# EAGLE schematic Schematic (EAGLE 9.7.0)

## Sheet 1 of 4: Power
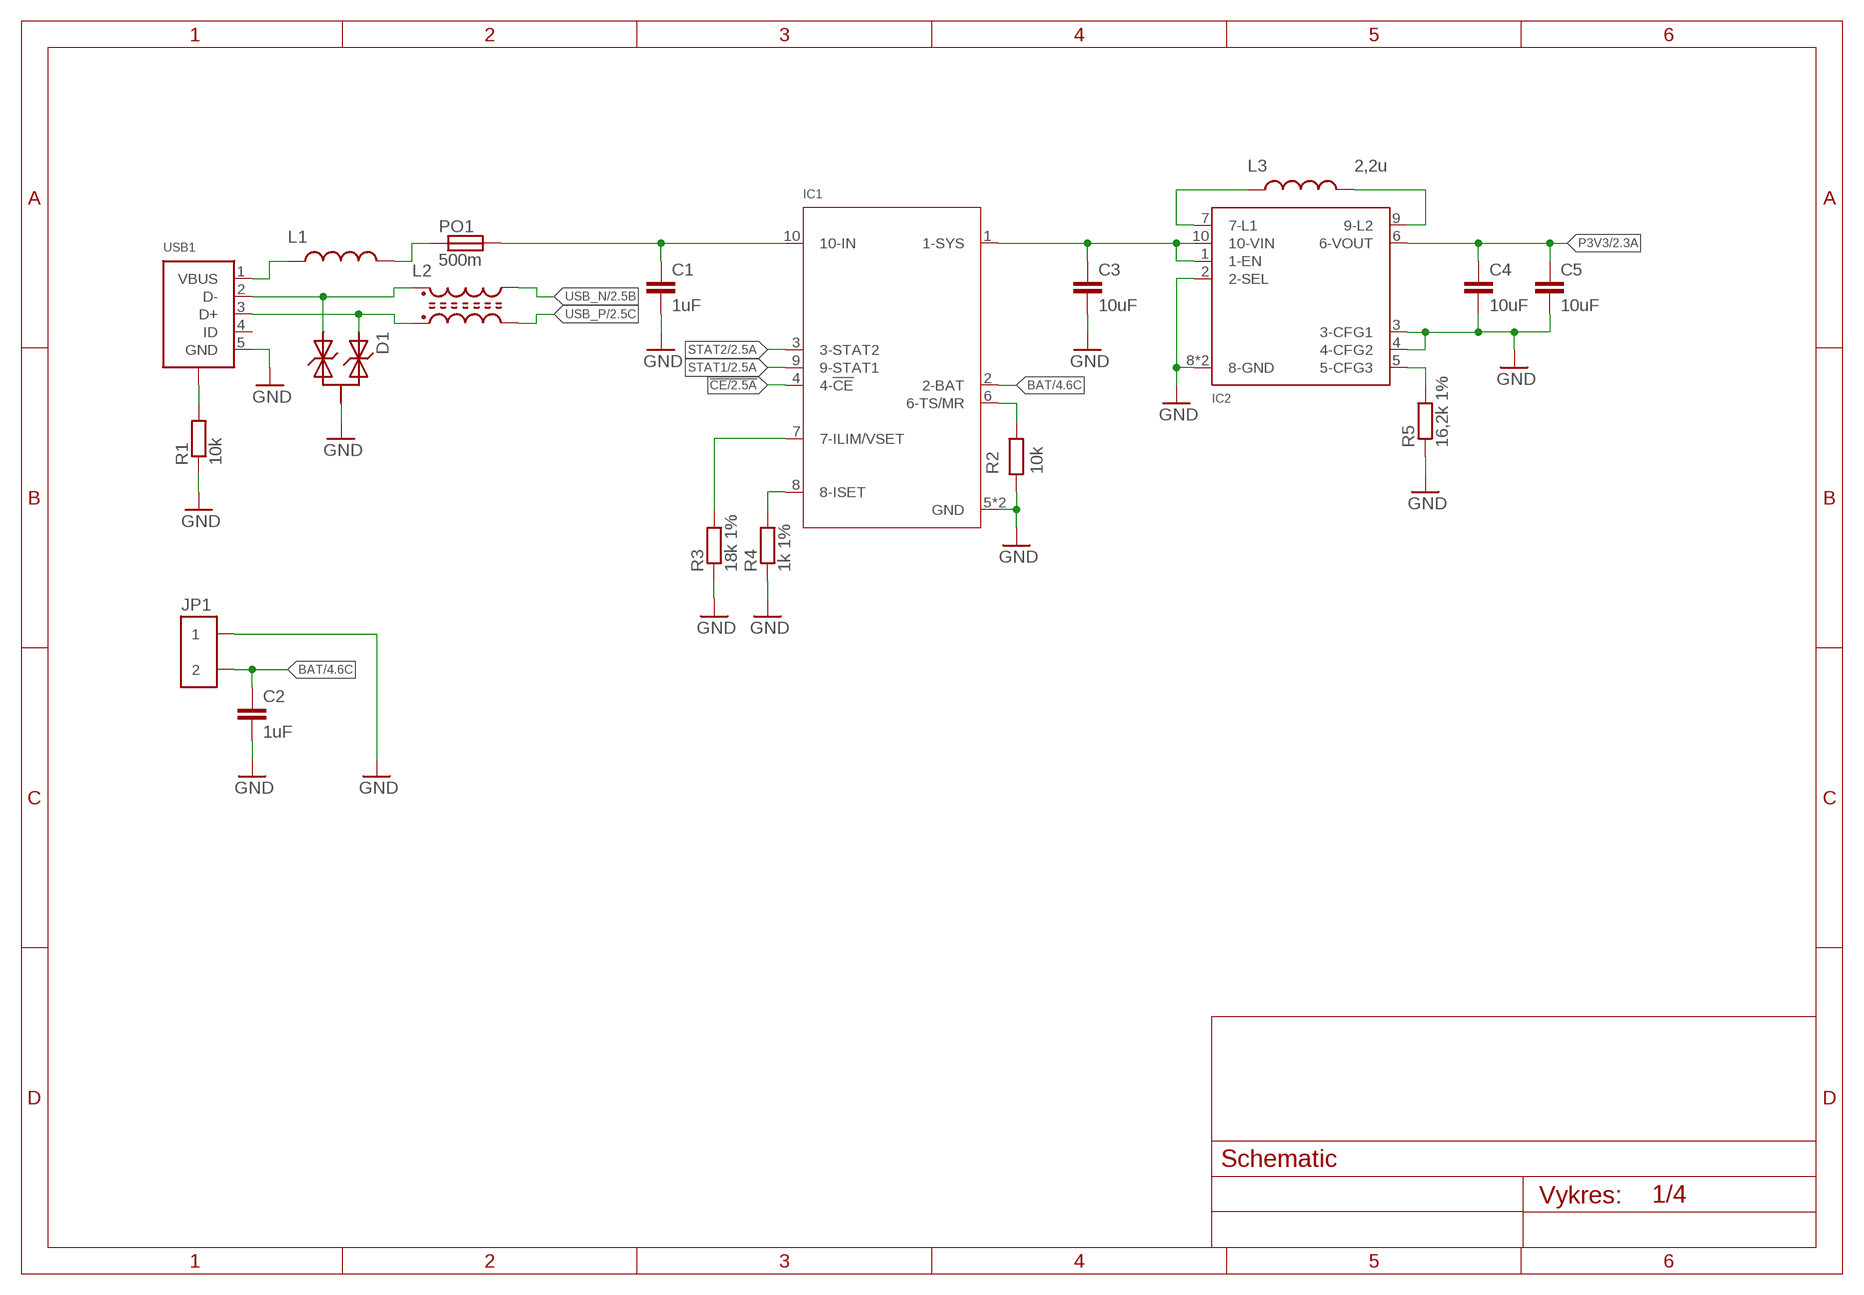
[diagram p0: schematic, sheet 1]

### Parts
C1  1uF  C-EU0603  [CAP-0603]
C2  1uF  C-EU0603  [CAP-0603]
C3  10uF  C-EU0603  [CAP-0603]
C4  10uF  C-EU0603  [CAP-0603]
C5  10uF  C-EU0603  [CAP-0603]
D1  DIODE-TVS-2SOT23-R  [SOT23-R]
IC1  BQ25185WSON-10-2.2X2MM  [WSON-10-2.2X2MM]
IC2  TPS63900WSON-10-2.5X2.5MM  [WSON-10-2.5X2.5MM]
JP1  JSTJST-B2B-PH-ANGLED  [JST-B2B-PH-ANGLED]
L1  INDUCTOR0603  [IND-0603]
L2  INDUCTOR-CHOKEIND-CHOKE-0805  [IND-CHOKE-0805]
L3  2,2u  INDUCTOR0805  [IND-0805]
PO1  500m  FUSE0805  [PTC-0805]
R1  10k  RESISTOR0402  [RES-0402]
R2  10k  RESISTOR0402  [RES-0402]
R3  18k 1%  RESISTOR0402  [RES-0402]
R4  1k 1%  RESISTOR0402  [RES-0402]
R5  16,2k 1%  RESISTOR0402  [RES-0402]
USB1  MICRO-USBMICRO-USB  [MICRO-USB]

### Nets
!CE: IC1.4(4-!CE) ; also sheet 2
BAT: C2.1 IC1.2(2-BAT) JP1.P$2 ; also sheet 4
CON-USB_N: D1.2 L2.1 USB1.2(D-)
CON-USB_P: D1.1 L2.4 USB1.3(D+)
GND: C1.2 C2.2 C3.2 C4.2 C5.2 D1.3 IC1.5(GND) IC1.11(GND) IC2.2(2-SEL) IC2.3(3-CFG1) IC2.4(4-CFG2) IC2.8(8-GND) IC2.11(8-GND) JP1.P$1 R1.1 R2.1 R3.1 R4.1 R5.1 USB1.5(GND) ; also sheet 2,3,4
ILIM: IC1.7(7-ILIM/VSET) R3.2
IN: C1.1 IC1.10(10-IN) PO1.2
ISET: IC1.8(8-ISET) R4.2
LX1: IC2.7(7-L1) L3.1
LX2: IC2.9(9-L2) L3.2
N$11: IC2.5(5-CFG3) R5.2
P3V3: C4.1 C5.1 IC2.6(6-VOUT) ; also sheet 2,3,4
SHIELD: R1.2 USB1.6(SHIELD) USB1.7(SHIELD) USB1.8(SHIELD) USB1.9(SHIELD) USB1.10(SHIELD) USB1.11(SHIELD)
STAT1: IC1.9(9-STAT1) ; also sheet 2
STAT2: IC1.3(3-STAT2) ; also sheet 2
SYS: C3.1 IC1.1(1-SYS) IC2.1(1-EN) IC2.10(10-VIN)
TS: IC1.6(6-TS/MR) R2.2
USB-VBUS: L1.1 USB1.1(VBUS)
USB_N: L2.2 ; also sheet 2
USB_P: L2.3 ; also sheet 2
VBUS-FUSE: L1.2 PO1.1
Unconnected: USB1.4(ID)

## Sheet 2 of 4: MCU
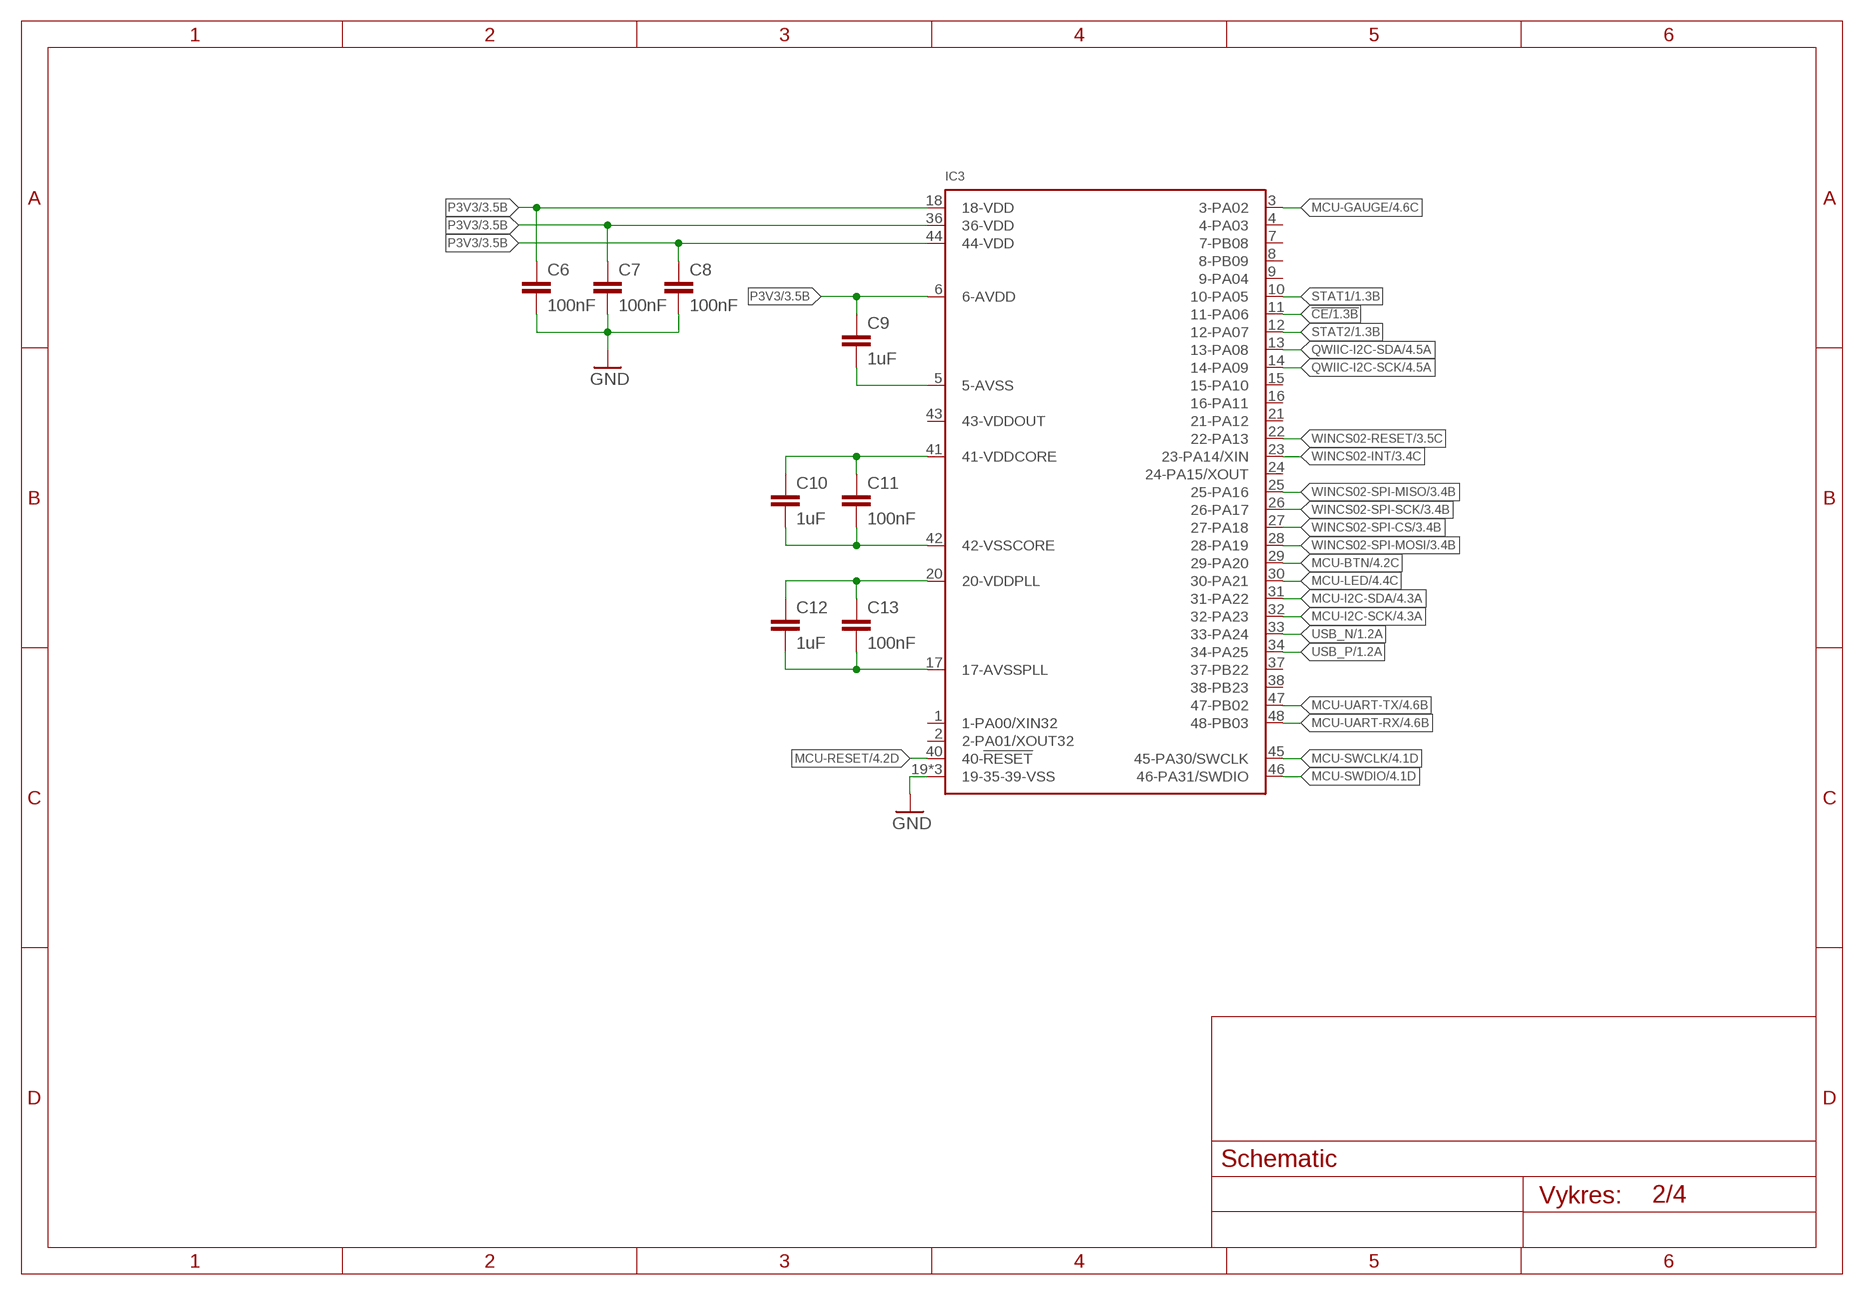
[diagram p1: schematic, sheet 2]

### Parts
C6  100nF  C-EU0402  [CAP-0402]
C7  100nF  C-EU0402  [CAP-0402]
C8  100nF  C-EU0402  [CAP-0402]
C9  1uF  C-EU0603  [CAP-0603]
C10  1uF  C-EU0603  [CAP-0603]
C11  100nF  C-EU0402  [CAP-0402]
C12  1uF  C-EU0603  [CAP-0603]
C13  100nF  C-EU0402  [CAP-0402]
IC3  PIC32CM2532LE00048TQFP-48  [TQFP-48]

### Nets
!CE: IC3.11(11-PA06) ; also sheet 1
GND: C6.2 C7.2 C8.2 C9.2 C10.2 C11.2 C12.2 C13.2 IC3.5(5-AVSS) IC3.17(17-AVSSPLL) IC3.19(19-35-39-VSS) IC3.35(19-35-39-VSS) IC3.39(19-35-39-VSS) IC3.42(42-VSSCORE) ; also sheet 1,3,4
MCU-BTN: IC3.29(29-PA20) ; also sheet 4
MCU-GAUGE: IC3.3(3-PA02) ; also sheet 4
MCU-I2C-SCK: IC3.32(32-PA23) ; also sheet 4
MCU-I2C-SDA: IC3.31(31-PA22) ; also sheet 4
MCU-LED: IC3.30(30-PA21) ; also sheet 4
MCU-RESET: IC3.40(40-!RESET) ; also sheet 4
MCU-SWCLK: IC3.45(45-PA30/SWCLK) ; also sheet 4
MCU-SWDIO: IC3.46(46-PA31/SWDIO) ; also sheet 4
MCU-UART-RX: IC3.48(48-PB03) ; also sheet 4
MCU-UART-TX: IC3.47(47-PB02) ; also sheet 4
P3V3: C6.1 C7.1 C8.1 C9.1 IC3.6(6-AVDD) IC3.18(18-VDD) IC3.36(36-VDD) IC3.44(44-VDD) ; also sheet 1,3,4
QWIIC-I2C-SCK: IC3.14(14-PA09) ; also sheet 4
QWIIC-I2C-SDA: IC3.13(13-PA08) ; also sheet 4
STAT1: IC3.10(10-PA05) ; also sheet 1
STAT2: IC3.12(12-PA07) ; also sheet 1
USB_N: IC3.33(33-PA24) ; also sheet 1
USB_P: IC3.34(34-PA25) ; also sheet 1
VDDCORE: C10.1 C11.1 IC3.41(41-VDDCORE)
VDDPLL: C12.1 C13.1 IC3.20(20-VDDPLL)
WINCS02-INT: IC3.23(23-PA14/XIN) ; also sheet 3
WINCS02-RESET: IC3.22(22-PA13) ; also sheet 3
WINCS02-SPI-CS: IC3.27(27-PA18) ; also sheet 3
WINCS02-SPI-MISO: IC3.25(25-PA16) ; also sheet 3
WINCS02-SPI-MOSI: IC3.28(28-PA19) ; also sheet 3
WINCS02-SPI-SCK: IC3.26(26-PA17) ; also sheet 3
Unconnected: IC3.1(1-PA00/XIN32) IC3.2(2-PA01/XOUT32) IC3.4(4-PA03) IC3.7(7-PB08) IC3.8(8-PB09) IC3.9(9-PA04) IC3.15(15-PA10) IC3.16(16-PA11) IC3.21(21-PA12) IC3.24(24-PA15/XOUT) IC3.37(37-PB22) IC3.38(38-PB23) IC3.43(43-VDDOUT)

## Sheet 3 of 4: Wi-Fi
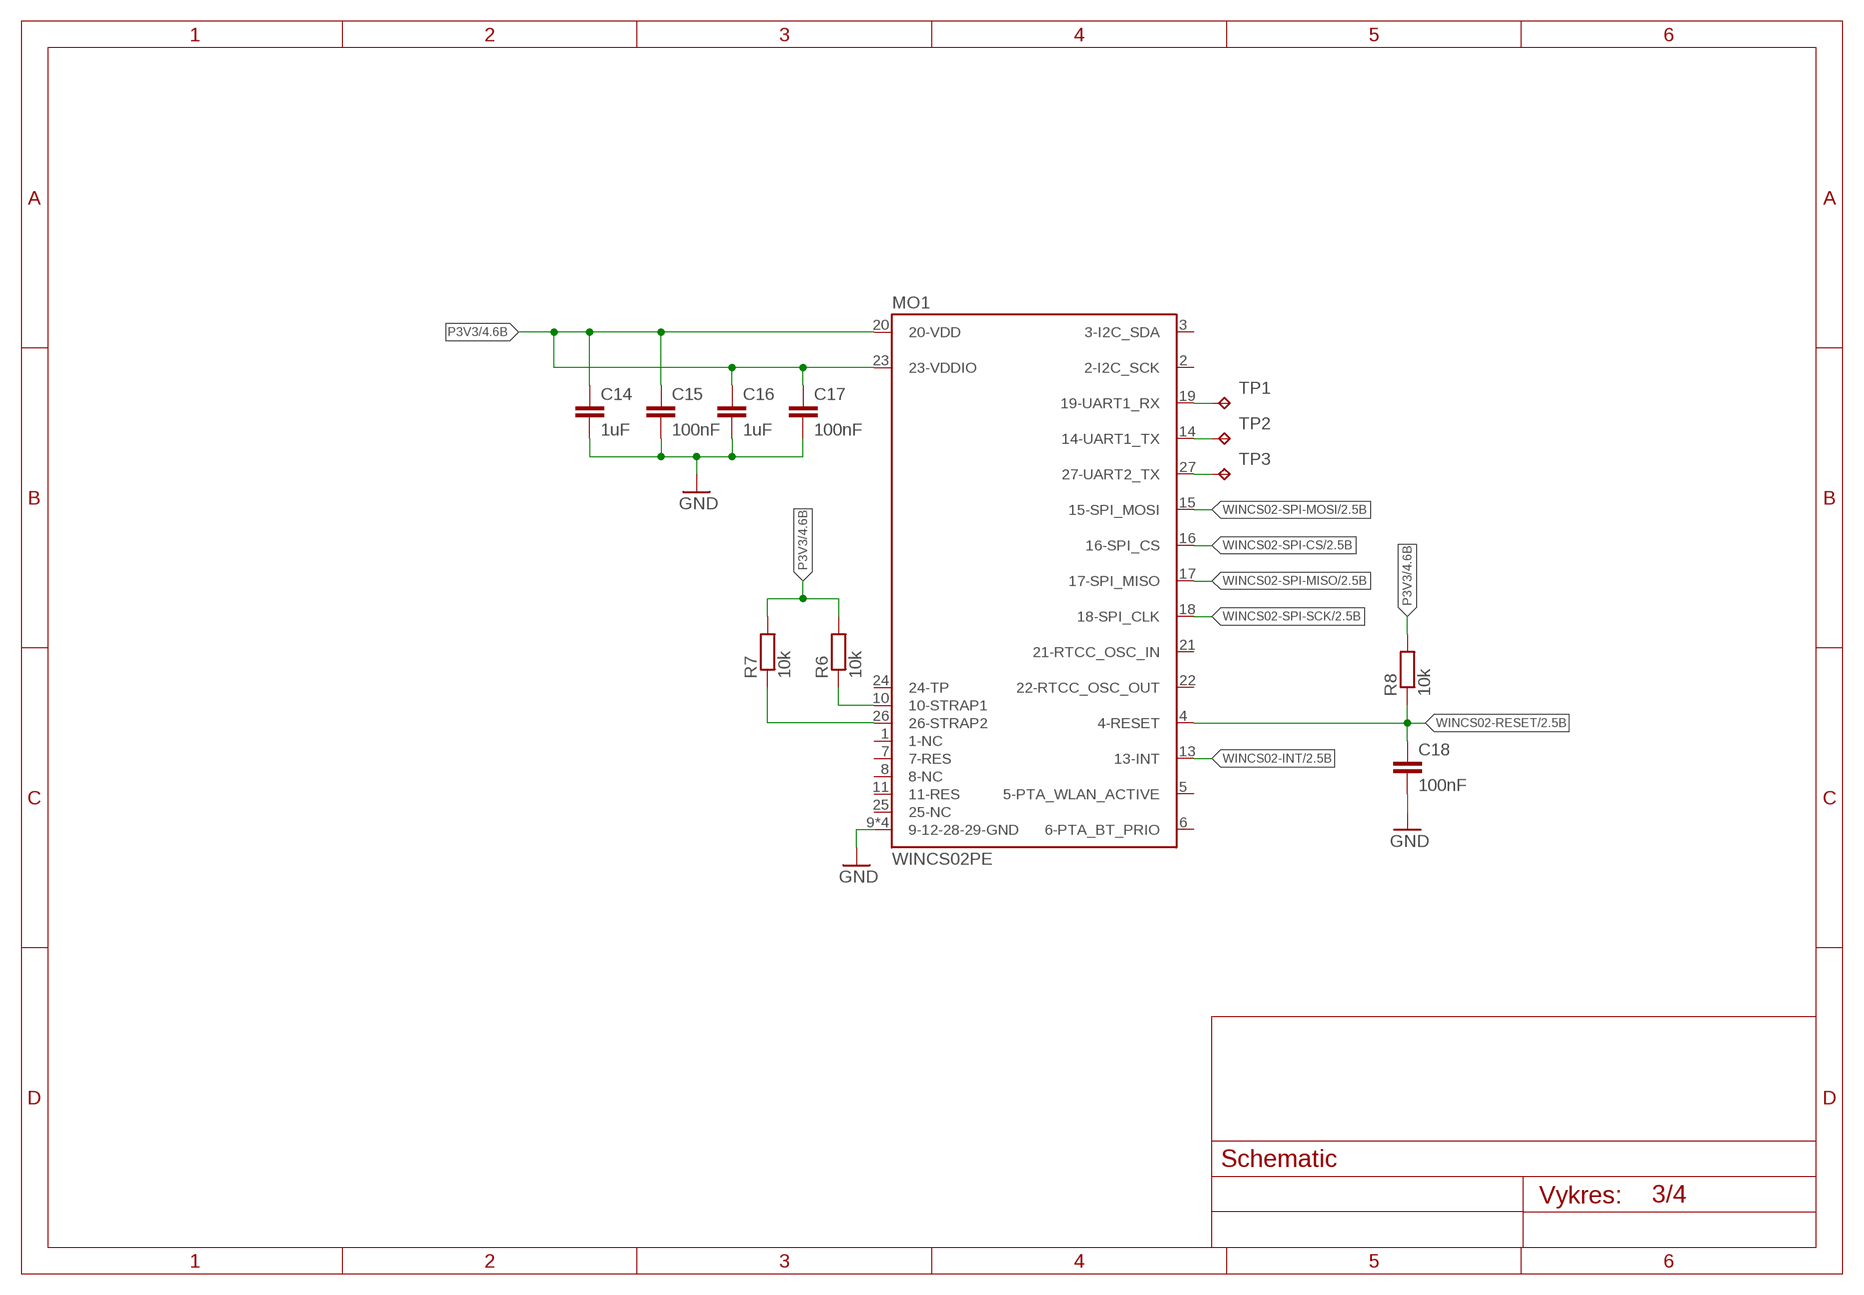
[diagram p2: schematic, sheet 3]

### Parts
C14  1uF  C-EU0603  [CAP-0603]
C15  100nF  C-EU0402  [CAP-0402]
C16  1uF  C-EU0603  [CAP-0603]
C17  100nF  C-EU0402  [CAP-0402]
C18  100nF  C-EU0402  [CAP-0402]
MO1  WINCS02PE  WINCS02PWINCS02  [WINCS02P]
R6  10k  RESISTOR0402  [RES-0402]
R7  10k  RESISTOR0402  [RES-0402]
R8  10k  RESISTOR0402  [RES-0402]
TP1  TPB1,00  [B1,00]
TP2  TPB1,00  [B1,00]
TP3  TPB1,00  [B1,00]

### Nets
GND: C14.2 C15.2 C16.2 C17.2 C18.2 MO1.9(9-12-28-29-GND) MO1.12(9-12-28-29-GND) MO1.28(9-12-28-29-GND) MO1.29(9-12-28-29-GND) ; also sheet 1,2,4
P3V3: C14.1 C15.1 C16.1 C17.1 MO1.20(20-VDD) MO1.23(23-VDDIO) R6.2 R7.2 R8.2 ; also sheet 1,2,4
STRAP1: MO1.10(10-STRAP1) R6.1
STRAP2: MO1.26(26-STRAP2) R7.1
UART1_RX: MO1.19(19-UART1_RX) TP1.TP
UART1_TX: MO1.14(14-UART1_TX) TP2.TP
UART2_TX: MO1.27(27-UART2_TX) TP3.TP
WINCS02-INT: MO1.13(13-INT) ; also sheet 2
WINCS02-RESET: C18.1 MO1.4(4-RESET) R8.1 ; also sheet 2
WINCS02-SPI-CS: MO1.16(16-SPI_CS) ; also sheet 2
WINCS02-SPI-MISO: MO1.17(17-SPI_MISO) ; also sheet 2
WINCS02-SPI-MOSI: MO1.15(15-SPI_MOSI) ; also sheet 2
WINCS02-SPI-SCK: MO1.18(18-SPI_CLK) ; also sheet 2
Unconnected: MO1.1(1-NC) MO1.2(2-I2C_SCK) MO1.3(3-I2C_SDA) MO1.5(5-PTA_WLAN_ACTIVE) MO1.6(6-PTA_BT_PRIO) MO1.7(7-RES) MO1.8(8-NC) MO1.11(11-RES) MO1.21(21-RTCC_OSC_IN) MO1.22(22-RTCC_OSC_OUT) MO1.24(24-TP) MO1.25(25-NC)

## Sheet 4 of 4: Accesories
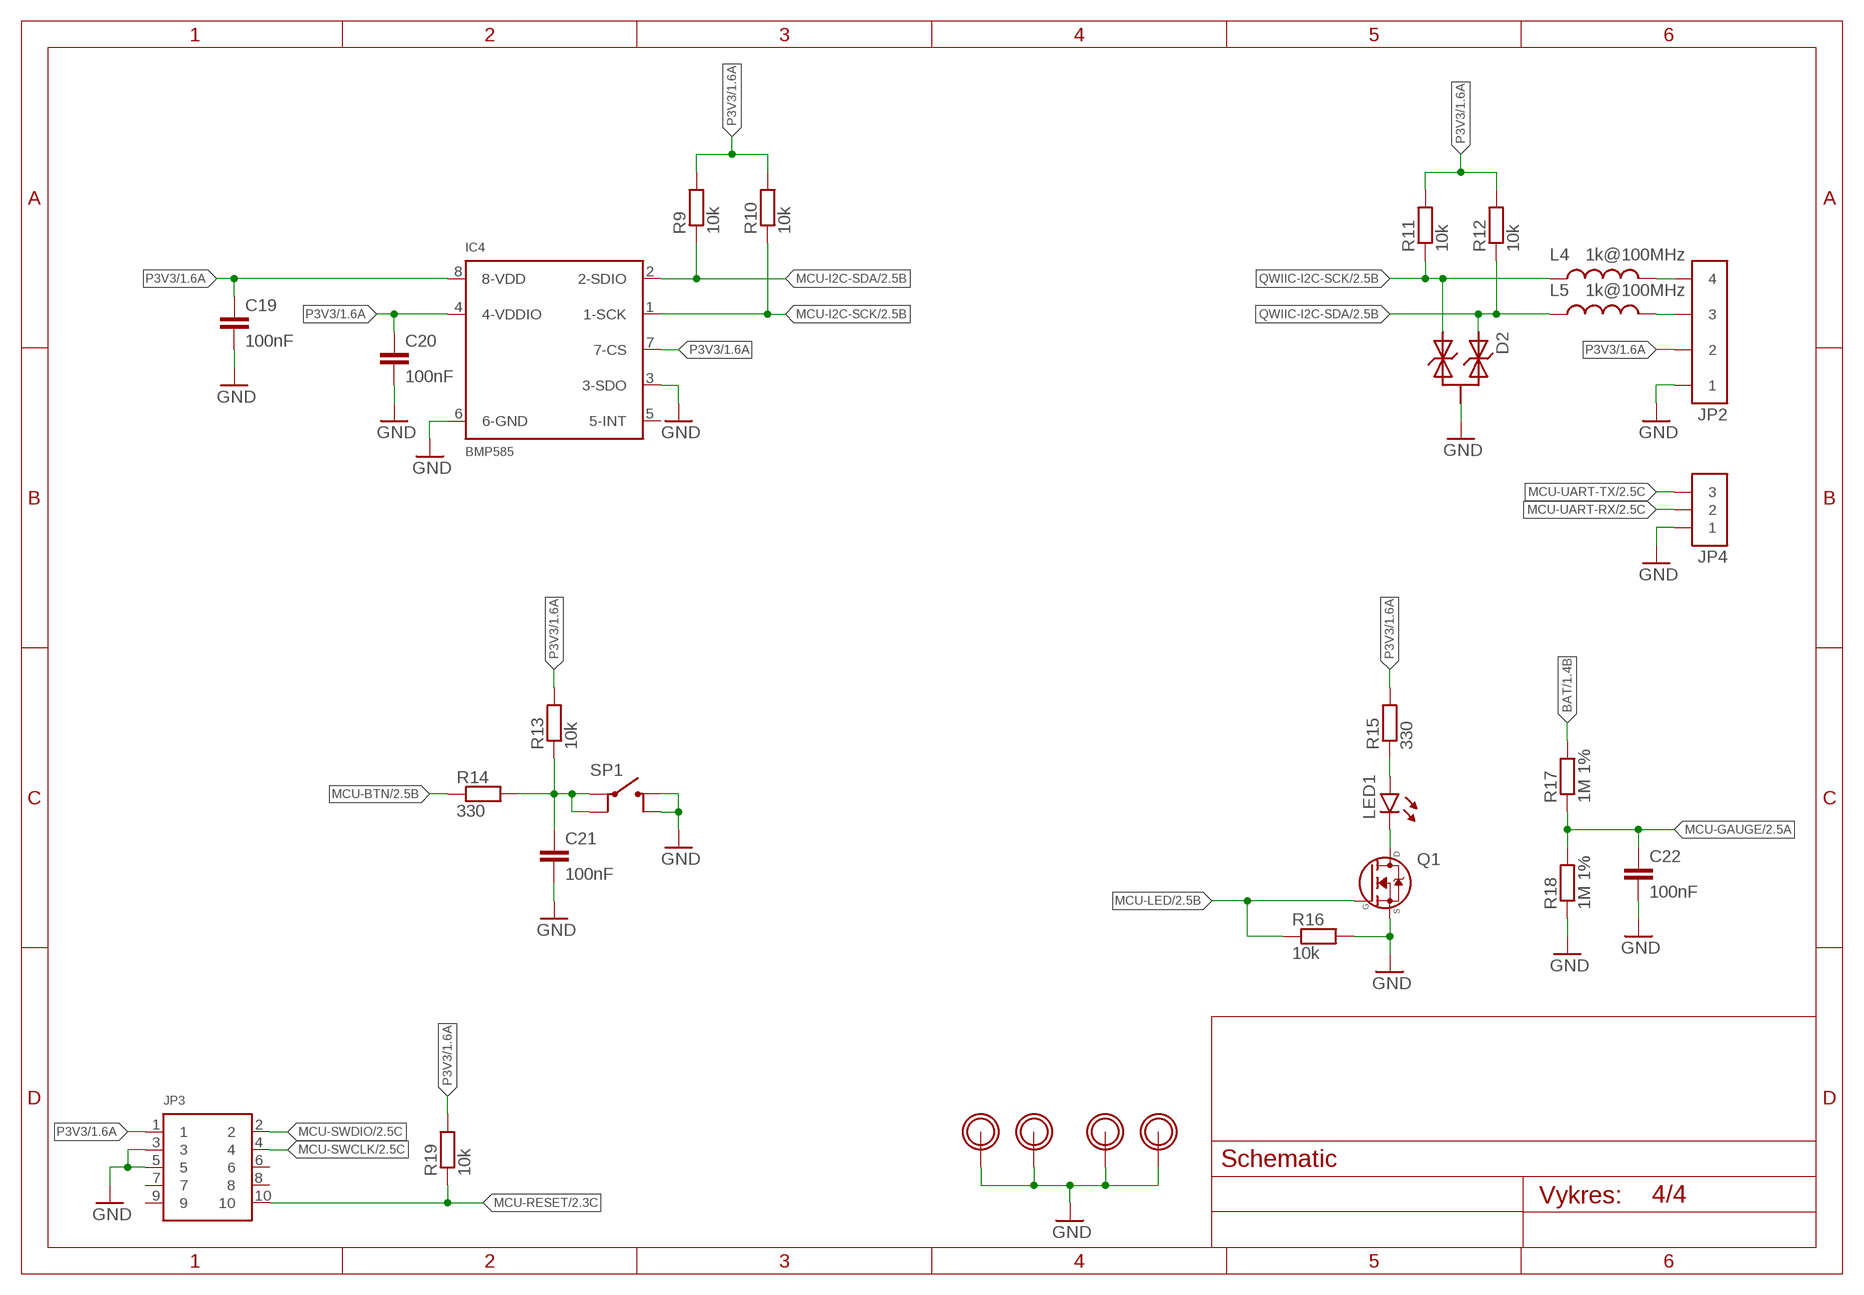
[diagram p3: schematic, sheet 4]

### Parts
C19  100nF  C-EU0402  [CAP-0402]
C20  100nF  C-EU0402  [CAP-0402]
C21  100nF  C-EU0402  [CAP-0402]
C22  100nF  C-EU0402  [CAP-0402]
D2  DIODE-TVS-2SOT23-R  [SOT23-R]
IC4  BMP585  BMP585BMP585  [BMP585]
JP2  QWIICQWIIC  [QWIIC]
JP3  HEADER_2X5  [2X5-1.27]
JP4  HEADER_1X32.54  [1X3-2.54MM]
L4  1k@100MHz  INDUCTOR0603  [IND-0603]
L5  1k@100MHz  INDUCTOR0603  [IND-0603]
LED1  LEDLED-0603  [DIODE-0603]
MD1  MOUNTING_HOLE2.5-THICK  [MOUNTINGHOLE-2.5-PLATED-THICK]
MD2  MOUNTING_HOLE2.5-THICK  [MOUNTINGHOLE-2.5-PLATED-THICK]
MD3  MOUNTING_HOLE2.5-THICK  [MOUNTINGHOLE-2.5-PLATED-THICK]
MD4  MOUNTING_HOLE2.5-THICK  [MOUNTINGHOLE-2.5-PLATED-THICK]
Q1  MOSFET-NSOT23-R  [SOT23-R]
R9  10k  RESISTOR0402  [RES-0402]
R10  10k  RESISTOR0402  [RES-0402]
R11  10k  RESISTOR0402  [RES-0402]
R12  10k  RESISTOR0402  [RES-0402]
R13  10k  RESISTOR0402  [RES-0402]
R14  330  RESISTOR0402  [RES-0402]
R15  330  RESISTOR0402  [RES-0402]
R16  10k  RESISTOR0402  [RES-0402]
R17  1M 1%  RESISTOR0402  [RES-0402]
R18  1M 1%  RESISTOR0402  [RES-0402]
R19  10k  RESISTOR0402  [RES-0402]
SP1  SWITCHKMR221G-LFS  [KMR221G-LFS]

### Nets
A: LED1.A R15.1
BAT: R17.2 ; also sheet 1
BTN: C21.1 R13.1 R14.2 SP1.1 SP1.3
GND: C19.2 C20.2 C21.2 C22.2 D2.3 IC4.3(3-SDO) IC4.6(6-GND) JP2.1 JP3.3 JP3.5 JP4.1 MD1.P$1 MD2.P$1 MD3.P$1 MD4.P$1 Q1.2(S) R16.2 R18.1 SP1.2 SP1.4 ; also sheet 1,2,3
K: LED1.K Q1.3(D)
MCU-BTN: R14.1 ; also sheet 2
MCU-GAUGE: C22.1 R17.1 R18.2 ; also sheet 2
MCU-I2C-SCK: IC4.1(1-SCK) R10.1 ; also sheet 2
MCU-I2C-SDA: IC4.2(2-SDIO) R9.1 ; also sheet 2
MCU-LED: Q1.1(G) R16.1 ; also sheet 2
MCU-RESET: JP3.10 R19.1 ; also sheet 2
MCU-SWCLK: JP3.4 ; also sheet 2
MCU-SWDIO: JP3.2 ; also sheet 2
MCU-UART-RX: JP4.2 ; also sheet 2
MCU-UART-TX: JP4.3 ; also sheet 2
N$3: JP2.4 L4.2
N$4: JP2.3 L5.2
P3V3: C19.1 C20.1 IC4.4(4-VDDIO) IC4.7(7-CS) IC4.8(8-VDD) JP2.2 JP3.1 R9.2 R10.2 R11.2 R12.2 R13.2 R15.2 R19.2 ; also sheet 1,2,3
QWIIC-I2C-SCK: D2.2 L4.1 R11.1 ; also sheet 2
QWIIC-I2C-SDA: D2.1 L5.1 R12.1 ; also sheet 2
Unconnected: IC4.5(5-INT) JP3.6 JP3.7 JP3.8 JP3.9

## Library data of the parts
C1-C22 = ZPR Library:C-EU
D1 D2 = ZPR Library:DIODE-TVS-2
IC1 = ZPR Library:BQ25185
IC2 = ZPR Library:TPS63900
IC3 = ZPR Library:PIC32CM2532LE00048
IC4 = ZPR Library:BMP585
JP1 = ZPR Library:JST
JP2 = ZPR Library:QWIIC
JP3 = ZPR Library:HEADER_2X5
JP4 = ZPR Library:HEADER_1X3
L1 L3-L5 = ZPR Library:INDUCTOR
L2 = ZPR Library:INDUCTOR-CHOKE
LED1 = ZPR Library:LED
MD1-MD4 = ZPR Library:MOUNTING_HOLE
MO1 = ZPR Library:WINCS02P
PO1 = ZPR Library:FUSE
Q1 = ZPR Library:MOSFET-N
R1-R19 = ZPR Library:RESISTOR
SP1 = ZPR Library:SWITCH
TP1-TP3 = ZPR Library:TP
USB1 = ZPR Library:MICRO-USB